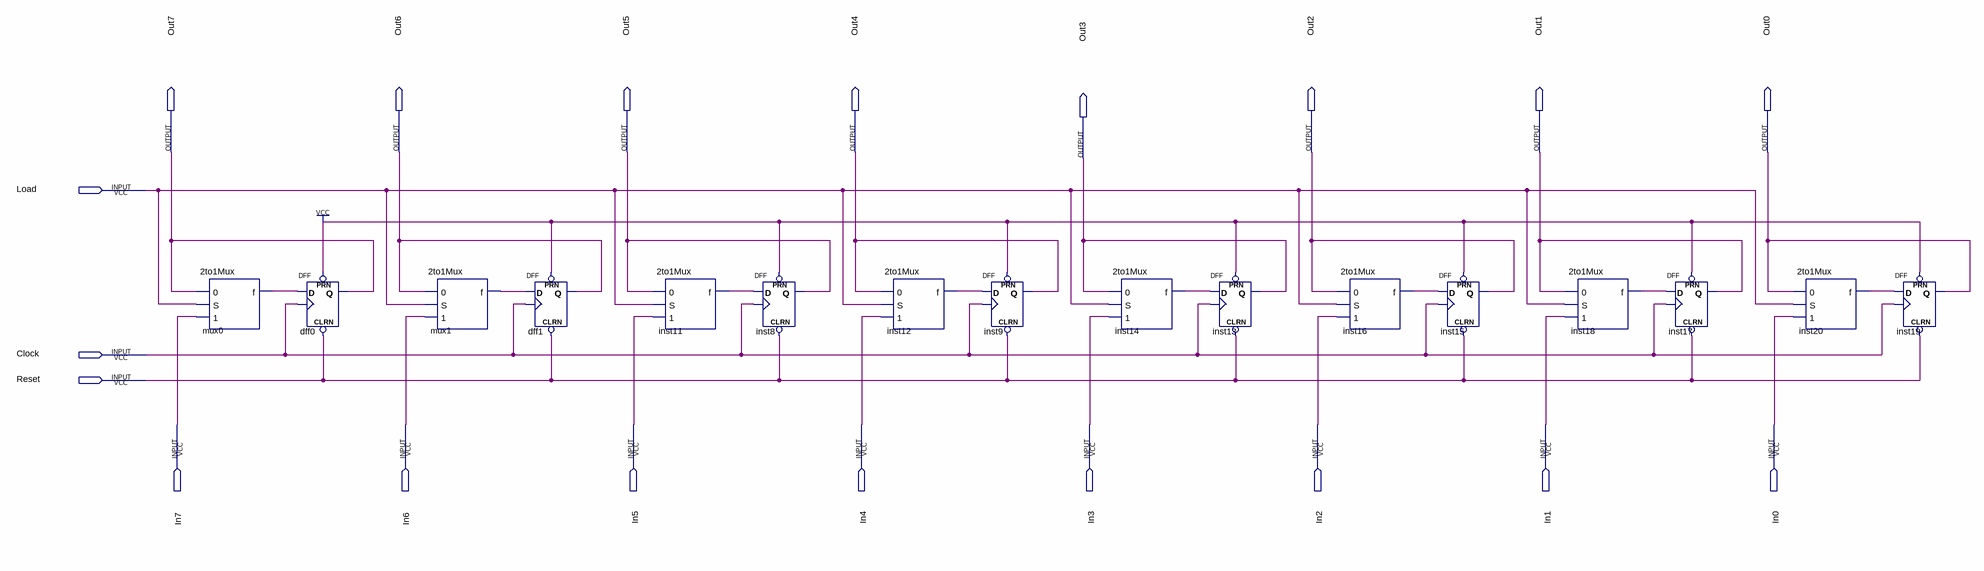
[diagram p0: schematic sheet]
// Quartus schematic 8_Bit_Parallel_Access_Register.bdf as structural Verilog: 16 symbols, 19 pins
module \8_Bit_Parallel_Access_Register  (
  input  Load,
  input  Clock,
  input  Reset,
  input  In7,
  input  In6,
  input  In5,
  input  In4,
  input  In3,
  input  In2,
  input  In1,
  input  In0,
  output Out7,
  output Out6,
  output Out5,
  output Out4,
  output Out2,
  output Out1,
  output Out0,
  output Out3
);

  wire inst11_f, inst12_f, inst14_f, inst16_f, inst18_f, inst20_f, mux0_f, mux1_f;

  \2to1Mux  mux0 (.\0 (Out7), .S(Load), .\1 (In7), .f(mux0_f));
  DFF dff0 (.CLRN(Reset), .CLK(Clock), .D(mux0_f), .PRN(1'b1), .Q(Out7));
  \2to1Mux  mux1 (.\0 (Out6), .S(Load), .\1 (In6), .f(mux1_f));
  DFF dff1 (.CLRN(Reset), .CLK(Clock), .D(mux1_f), .PRN(1'b1), .Q(Out6));
  \2to1Mux  inst11 (.\0 (Out5), .S(Load), .\1 (In5), .f(inst11_f));
  DFF inst8 (.CLRN(Reset), .CLK(Clock), .D(inst11_f), .PRN(1'b1), .Q(Out5));
  \2to1Mux  inst12 (.\0 (Out4), .S(Load), .\1 (In4), .f(inst12_f));
  DFF inst9 (.CLRN(Reset), .CLK(Clock), .D(inst12_f), .PRN(1'b1), .Q(Out4));
  \2to1Mux  inst14 (.\0 (Out3), .S(Load), .\1 (In3), .f(inst14_f));
  DFF inst13 (.CLRN(Reset), .CLK(Clock), .D(inst14_f), .PRN(1'b1), .Q(Out3));
  \2to1Mux  inst16 (.\0 (Out2), .S(Load), .\1 (In2), .f(inst16_f));
  DFF inst15 (.CLRN(Reset), .CLK(Clock), .D(inst16_f), .PRN(1'b1), .Q(Out2));
  \2to1Mux  inst18 (.\0 (Out1), .S(Load), .\1 (In1), .f(inst18_f));
  DFF inst17 (.CLRN(Reset), .CLK(Clock), .D(inst18_f), .PRN(1'b1), .Q(Out1));
  \2to1Mux  inst20 (.\0 (Out0), .S(Load), .\1 (In0), .f(inst20_f));
  DFF inst19 (.CLRN(Reset), .CLK(Clock), .D(inst20_f), .PRN(1'b1), .Q(Out0));
endmodule
